# EAGLE design door (EAGLE 7.7.0)
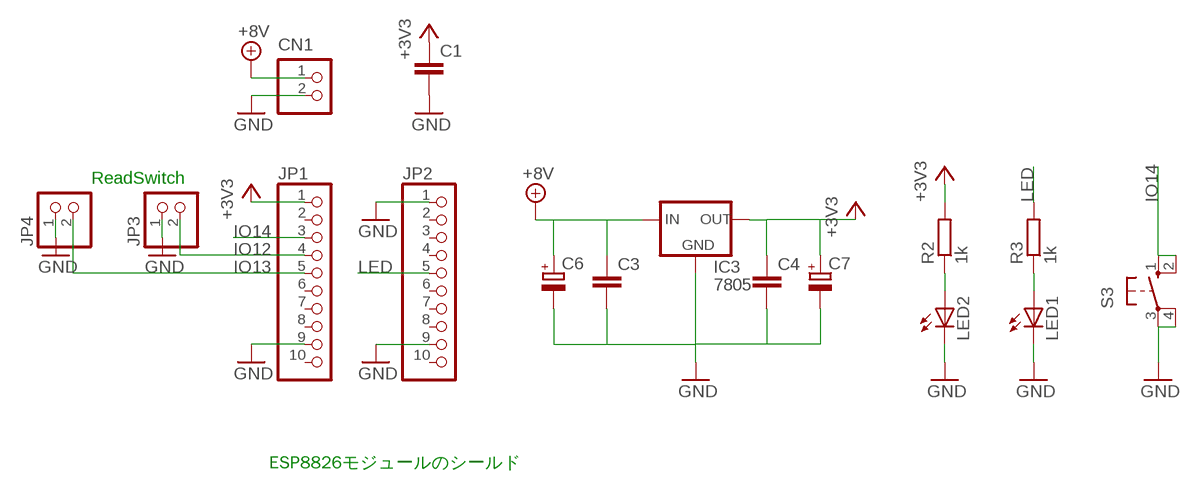
[diagram p0: schematic, sheet 1]

## Parts
C1  C-EU050-024X044  [C050-024X044]
C3  C-EU050-024X044  [C050-024X044]
C4  C-EU050-024X044  [C050-024X044]
C6  CPOL-EUE5-4  [E5-4]
C7  CPOL-EUE5-4  [E5-4]
CN1  S2B-PH-K-S  [S2B-PH-K-S]
IC3  7805  [TO220_V]
JP1  PINHD-1X10  [1X10]
JP2  PINHD-1X10  [1X10]
JP3  PINHD-1X2/90  [1X02/90]
JP4  PINHD-1X2/90  [1X02/90]
LED1  LEDSML0603  [SML0603]
LED2  LEDSML0603  [SML0603]
R2  1k  R-EU_0207/10  [0207/10]
R3  1k  R-EU_0207/10  [0207/10]
S3  10-XX  [B3F-10XX]

## Nets
+3V3: C1.1 C4.1 C7.+ IC3.3(OUT) JP1.1 R2.2
+8V: C3.1 C6.+ CN1.1 IC3.1(IN)
A [VCC]: LED2.A R2.1
B [VCC]: LED1.A R3.1
GND: C1.2 C3.2 C4.2 C6.- C7.- CN1.2 IC3.2(GND) JP1.9 JP2.1 JP2.9 JP3.1 JP4.1 LED1.C LED2.C S3.3(P) S3.4(P1)
IO12: JP1.4 JP3.2
IO13: JP1.5 JP4.2
IO14: JP1.3 S3.1(S) S3.2(S1)
LED: JP2.5 R3.2
Unconnected: JP1.2 JP1.6 JP1.7 JP1.8 JP1.10 JP2.2 JP2.3 JP2.4 JP2.6 JP2.7 JP2.8 JP2.10

## Notes on the sheet
- ReadSwitch
- ESP8826モジュールのシールド

## Library data of the parts
C1 C3 C4 = rcl:C-EU: CAPACITOR, European symbol
C6 C7 = rcl:CPOL-EU: POLARIZED CAPACITOR, European symbol
CN1 = jst-ph:S2B-PH-*: Wire-to-Board 2.0mm pitch side mount connector Source: http://www.jst-mfg.com/product/pdf/jpn/PH.pdf http://www.jst-mfg.com/product/detail.php?series=199
IC3 = VoltageRegulator:78*
JP1 JP2 = pinhead:PINHD-1X10: PIN HEADER
JP3 JP4 = pinhead:PINHD-1X2: PIN HEADER
LED1 LED2 = led:LED: LED OSRAM: - CHIPLED LG R971, LG N971, LY N971, LG Q971, LY Q971, LO R971, LY R971 LH N974, LH R974 LS Q976, LO Q976, LY Q976 LO Q996 - Hyper CHIPLED LW Q18S LB Q993, LB Q99A, LB R99A - SideLED LS A670, LO A670, LY A670, LG A670, LP A670 LB A673, LV A673, LT A673, LW A673 LH A674 LY A675 LS A676, LA A676, LO A676, LY A676, LW A676 LS A679, LY A679, LG A679 - Hyper Micro SIDELED® LS Y876, LA Y876, LO Y876, LY Y876 LT Y87S - SmartLED LW L88C, LW L88S LB L89C, LB L89S, LG L890 LS L89K, LO L89K, LY L89K LS L896, LA L896, LO L896, LY L896 - TOPLED LS T670, LO T670, LY T670, LG T670, LP T670 LSG T670, LSP T670, LSY T670, LOP T670, LYG T670 LG T671, LOG T671, LSG T671 LB T673, LV T673, LT T673, LW T673 LH T674 LS T676, LA T676, LO T676, LY T676, LB T676, LH T676, LSB T676, LW T676 LB T67C, LV T67C, LT T67C, LS T67K, LO T67K, LY T67K, LW E67C LS E67B, LA E67B, LO E67B, LY E67B, LB E67C, LV E67C, LT E67C LW T67C LS T679, LY T679, LG T679 LS T770, LO T770, LY T770, LG T770, LP T770 LB T773, LV T773, LT T773, LW T773 LH T774 LS E675, LA E675, LY E675, LS T675 LS T776, LA T776, LO T776, LY T776, LB T776 LHGB T686 LT T68C, LB T68C - Hyper Mini TOPLED® LB M676 - Mini TOPLED Santana® LG M470 LS M47K, LO M47K, LY M47K Source: http://www.osram.convergy.de LUXEON: - LUMILED® LXK2-PW12-R00, LXK2-PW12-S00, LXK2-PW14-U00, LXK2-PW14-V00 LXK2-PM12-R00, LXK2-PM12-S00, LXK2-PM14-U00 LXK2-PE12-Q00, LXK2-PE12-R00, LXK2-PE12-S00, LXK2-PE14-T00, LXK2-PE14-U00 LXK2-PB12-K00, LXK2-PB12-L00, LXK2-PB12-M00, LXK2-PB14-N00, LXK2-PB14-P00, LXK2-PB14-Q00 LXK2-PR12-L00, LXK2-PR12-M00, LXK2-PR14-Q00, LXK2-PR14-R00 LXK2-PD12-Q00, LXK2-PD12-R00, LXK2-PD12-S00 LXK2-PH12-R00, LXK2-PH12-S00 LXK2-PL12-P00, LXK2-PL12-Q00, LXK2-PL12-R00 Source: www.luxeon.com KINGBRIGHT: KA-3528ASYC Source: www.kingbright.com
R2 R3 = rcl:R-EU_: RESISTOR, European symbol
S3 = switch-omron:10-XX: OMRON SWITCH; MPN: B3F-1000; OC_FARNELL: 176432; OC_NEWARK: 36M3542

## Board
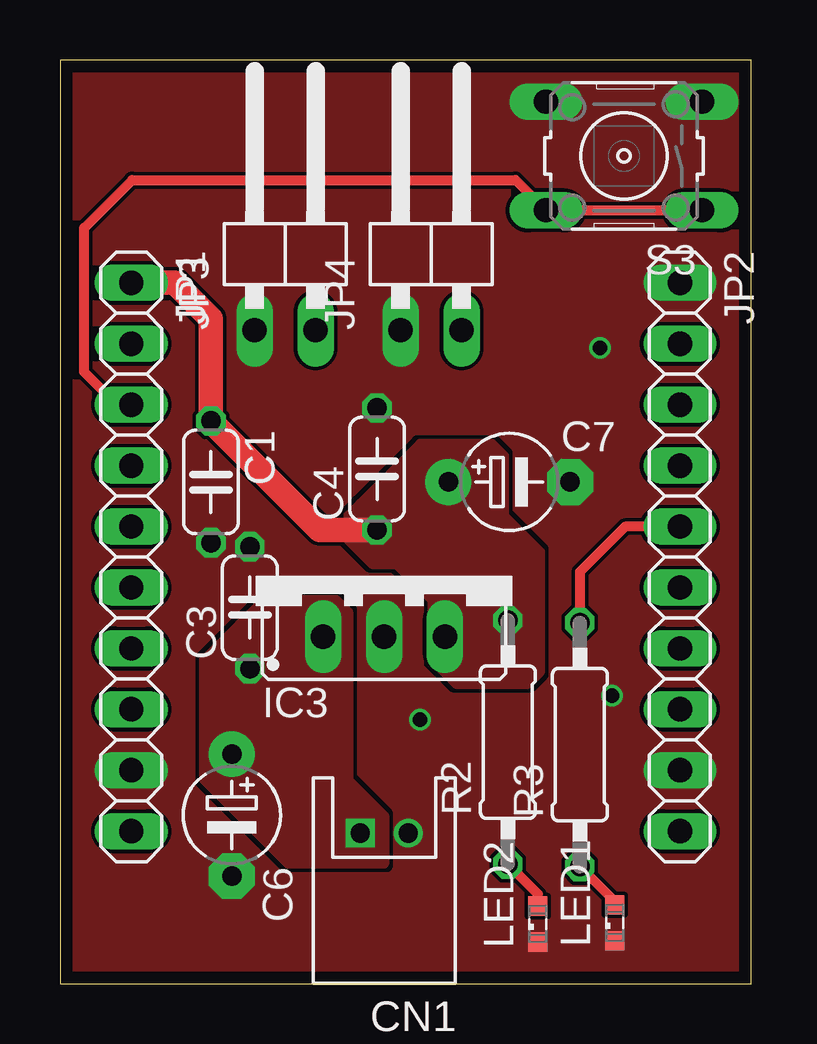
[diagram p1: board, top side]
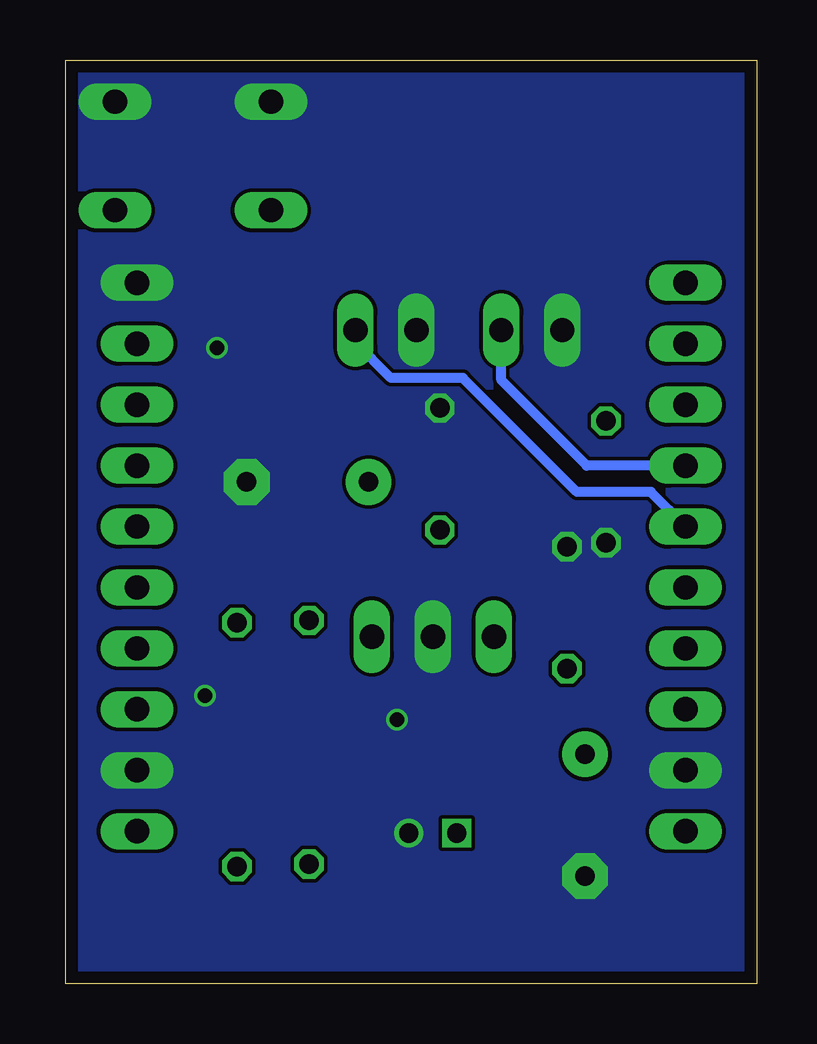
[diagram p2: board, bottom side, seen from below]

Size 28.8 x 38.5 mm. Coordinates in mm from the lower left corner, seen from the top.
Outline: 0,0 28.8,0 28.8,38.5 0,38.5 0,0
Copper layers (1*16): Top 0.035mm / dielectric 1.6mm / Bottom 0.035mm
Design rules "Elecrow_2-layer_PCB_eagle_rule": minimum track width 6mil, minimum drill 12mil, track to track 6mil, track to pad 6mil, pad to pad 6mil, via to via 8mil, smd to smd 0mil, copper to edge 20mil, drill to drill 10mil, minimum pad ring 6mil, minimum via ring 6mil, stop-mask expansion 0mil, vias tented up to drill 100mil, thermal gap 10mil

### Footprints (pad centres in the part's own frame; a part is rotated, then mirrored left to right if it is on the bottom)
C050-024X044 = drill 0.813 octagon: 1 -2.54,0; 2 2.54,0
E5-4 = drill 0.813 pad 1.905: + -2.54,0 | drill 0.813 pad 1.905 octagon: - 2.54,0
S2B-PH-K-S = drill 0.8 square: 1 1,0 | drill 0.8: 2 -1,0
TO220_V = drill 1.016 long: 1 -2.54,-2.54; 2 0,-2.54; 3 2.54,-2.54
1X10 = drill 1.016 long: 1 -11.43,0; 2 -8.89,0; 3 -6.35,0; 4 -3.81,0; 5 -1.27,0; 6 1.27,0; 7 3.81,0; 8 6.35,0; 9 8.89,0; 10 11.43,0
1X02/90 = drill 1.016 long: 1 -1.27,-3.81; 2 1.27,-3.81
SML0603 = smd 0.8 x 0.8: A 0.75,0; C -0.75,0
0207/10 = drill 0.813 octagon: 1 -5.08,0; 2 5.08,0
B3F-10XX = drill 1.016 long: 1 -3.251,2.261; 2 3.251,2.261; 3 -3.251,-2.261; 4 3.251,-2.261

### Placement (x,y rotation side)
C1  6.29,20.91 270 top
C3  7.91,15.67 90 top
C4  13.21,21.45 90 top
C6  7.16,7.02 270 top
C7  18.72,20.91 0 top
CN1  13.51,6.27 180 top
IC3  13.5,17 0 top
JP1  2.97,17.78 270 top
JP2  25.83,17.78 270 top
JP3  9.38,31.05 0 top
JP4  15.46,31.05 0 top
LED1  23.11,2.53 90 top
LED2  19.91,2.48 90 top
R2  18.66,10.06 90 top
R3  21.66,9.96 90 top
S3  23.5,34.5 180 top

### Tracks (layer width: path | path; a pad name or v marks a point on that pad's centre or on a via)
+3V3
  Top 1.016: JP1.1 4.79,29.21 6.29,27.71 C1.1 10.83,18.91 C4.1
  pour Top (no thermals): 15.5,14.5 15.5,13.5 16.5,12.5 19.5,12.5 20,13 20,18 18.5,19.5 18.5,22 18,22.5 15,22.5 12.5,20 12,19.5 12,18.5 13,17.5 14,17.5 15.5,16
+8V
  pour Top (no thermals): 13.5,6.5 13.5,5 10,5 9.5,5 6.5,8 6,8.5 6,12 6,13.5 7.5,15 8.5,16 10.5,16 11.5,16 12,15.5 12,8.5 13.5,7
A
  Top 0.406: LED2.A 19.91,3.73 R2.1
B
  Top 0.406: LED1.A 23.11,3.43 R3.1
GND  (via drill 0.6)
  other vias: 15,11 23,12 22.5,26.5
  pour Top (rank 6, no thermals): -5.08,39.37 -5.08,-3.81 30.48,-3.81 30.48,39.37
  pour Bottom (rank 6, no thermals): -6.5,33.5 -6.5,-4.5 30.5,-4.5 30.5,40 -4.5,40 -6.5,40
IO12
  Bottom 0.406: JP1.4 7.09,21.59 10.65,25.15 JP3.2
IO13
  Bottom 0.406: JP1.5 4.42,20.5 7.5,20.5 12.25,25.25 15.25,25.25 16.73,26.73 JP4.2
IO14
  Top 0.406: JP1.3 2.37,24.13 1,25.5 1,31.5 3,33.5 18.99,33.5 S3.2 S3.1
LED
  Top 0.406: JP2.5 23.55,19.05 21.66,17.16 R3.2